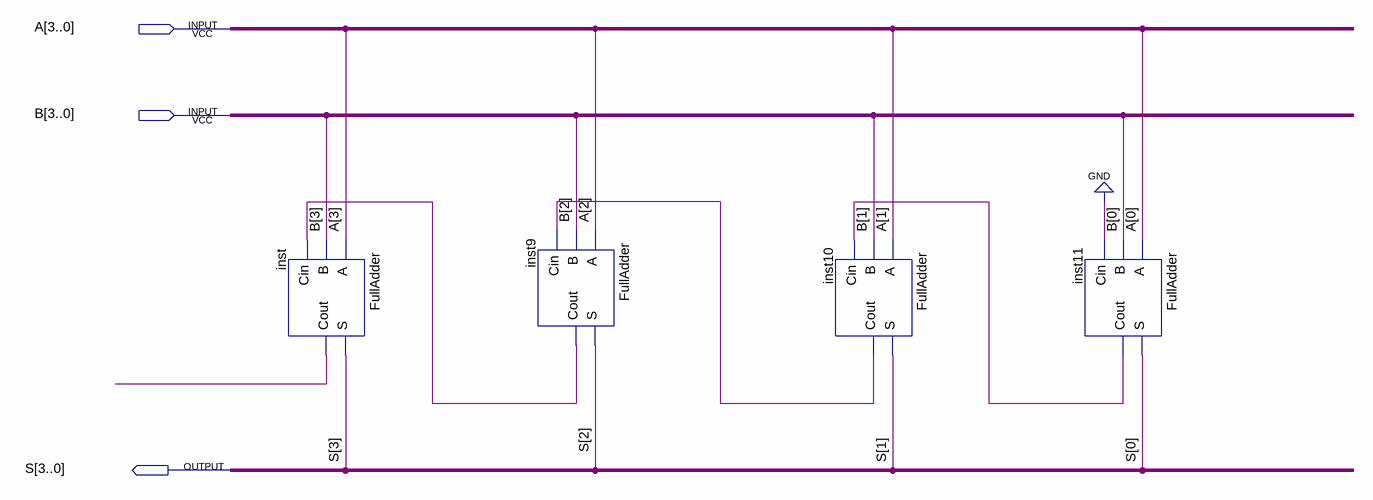
[diagram p0: schematic sheet]
// Quartus schematic Soma.bdf as structural Verilog: 4 symbols, 3 pins
module Soma (
  input  [3:0] A,
  input  [3:0] B,
  output [3:0] S
);

  wire inst9_cout, inst10_cout, inst11_cout, inst_cout;

  FullAdder inst (.A(A[3]), .B(B[3]), .Cin(inst9_cout), .S(S[3]), .Cout(inst_cout));
  FullAdder inst9 (.A(A[2]), .B(B[2]), .Cin(inst10_cout), .S(S[2]), .Cout(inst9_cout));
  FullAdder inst10 (.A(A[1]), .B(B[1]), .Cin(inst11_cout), .S(S[1]), .Cout(inst10_cout));
  FullAdder inst11 (.A(A[0]), .B(B[0]), .Cin(1'b0), .S(S[0]), .Cout(inst11_cout));
endmodule
